# Altium schematic sheet 2.SchDoc
size A4
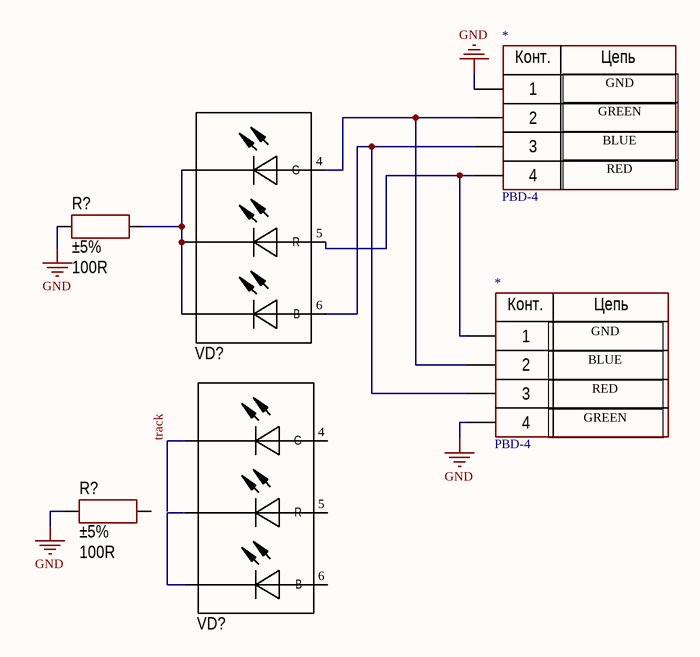
[diagram p0: 2.SchDoc]

## Parts
(Parts that share a designator on the sheet are numbered #1, #2 ... from top to bottom, then left to right.)
*#1  PBD-4  [PLD-4-R]
*#2  PBD-4  [PBD-4-RIGHT]
R?#1  value 100R  Tolerance: ±5%  [RES: 0603]
R?#2  value 100R  Tolerance: ±5%  [RES: 0603]
VD?#1  VD?  [RGB]  (value not drawn)
VD?#2  VD?  [RGB]  (value not drawn)

## Nets
GND: *#1.1 *#2.4 R?#1.2 R?#2.2
track: VD?#2.1(G)
Net*#1_2: *#1.2 *#2.2 VD?#1.4(G)
Net*#1_3: *#1.3 *#2.3 VD?#1.6(B)
Net*#1_4: *#1.4 *#2.1 VD?#1.5(R)
NetR?#1_1: R?#1.1 VD?#1.1(G) VD?#1.2(G) VD?#1.3(G)
NetVD?#2_2: VD?#2.2(G) VD?#2.3(G)

Not connected (* = marked no-connect by the designer): R?#2 1; VD?#2 4(G) 5(R) 6(B)

## Notes on the sheet
- GND
- GREEN
- BLUE
- RED
- (near *#2) GND
- (near *#2) BLUE
- (near *#2) RED
- (near *#2) GREEN
- (in symbol PBD-4) Конт.; Цепь

## Library data of the parts
R?#1 R?#2 = Resistor_0603: Manufacturer: Yageo; PartNumber: RC0603JR-07100RL; ValueManufacturerPartNumber: Resistor film, 100R, ±5%, 0603, 0.1W, -55...+125°C; TypeResistor: Resistor film; Power: 0.1W; Package: 0603; HelpURL: https://www.digikey.com/product-detail/en/yageo/RC0603JR-07100RL/311-100GRCT-ND/729644; Temperature: -55...+125°C
VD?#1 VD?#2 = RGB